# Altium schematic sheet SCH_03_Power.SchDoc
size A4; DrawnBy: Phung Nhat Minh; SheetNumber: 3; SheetTotal: 7
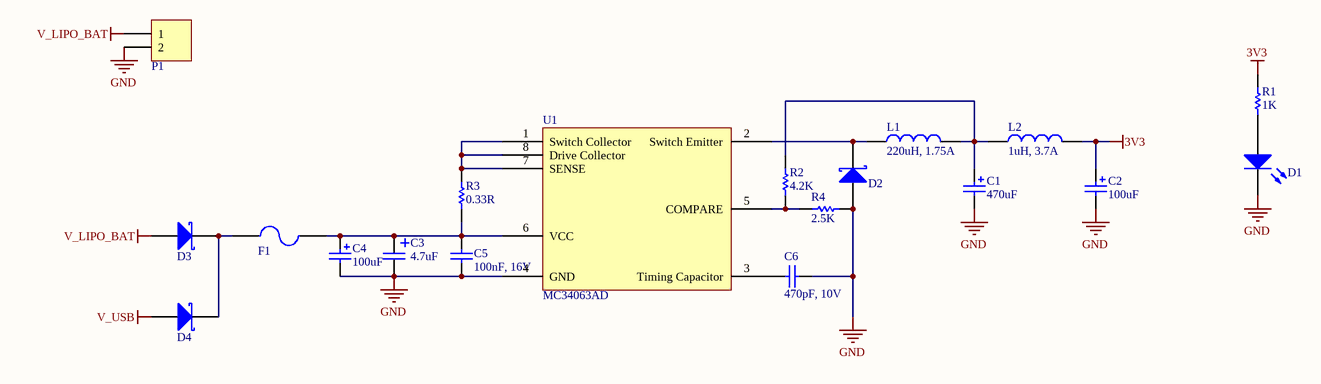
[diagram p0: SCH_03_Power.SchDoc]

## Parts
C1  value 470uF  [CAP ALU SIZE G]  (hidden comment: Cap Pol SMD)
C2  value 100uF  [CAP ALU SIZE D]  (hidden comment: Cap Pol SMD)
C3  value 4.7uF  [CAPMP3216X18N]  (hidden comment: Tantalum Capacitor)
C4  value 100uF  [CAP ALU SIZE D]  (hidden comment: Cap Pol SMD)
C5  100nF, 16V  [WCAP-CSGP_0805_H=0.8mm_Reflow]
C6  470pF, 10V  [WCAP-CSGP_0805_H=0.8mm_Reflow]
D1  LED SMD  [LED_0805_Blue]  (value not drawn)
D2  D Schottky  [SS34]  (value not drawn)
D3  D Schottky  [SS34]  (value not drawn)
D4  D Schottky  [SS34]  (value not drawn)
F1  Fuse  [FUSE SMD]  (value not drawn)
L1  220uH, 1.75A  [WE-PD2A_5848]
L2  1uH, 3.7A  [WE-PD2A_5848]
P1  Domino 2  [DOMINO 2- 5mm]  (value not drawn)
R1  value 1K  [RES-SM-0603]  (hidden comment: RESISTOR SMD)
R2  value 4.2K  [RES-SM-0805]  (hidden comment: RESISTOR SMD)
R3  value 0.33R  [RES-SM-0805]  (hidden comment: RESISTOR SMD)
R4  value 2.5K  [RES-SM-0805]  (hidden comment: RESISTOR SMD)
U1  MC34063AD  [SOIC127P600X170-8N]

## Nets
3V3: C2.1 L2.2 R1.2
GND: C1.2 C2.2 C3.2 C4.2 C5.1 C6.2 D1.2(K) D2.1(A) P1.2 R4.1 U1.4(GND)
V_LIPO_BAT: D3.1(A) P1.1
V_USB: D4.1(A)
NetC1_1: C1.1 L1.2 L2.1 R2.2
NetC3_1: C3.1 C4.1 C5.2 F1.2 R3.1 U1.6(VCC)
NetC6_1: C6.1 U1.3(Timing_Capacitor)
NetD1_1: D1.1(A) R1.1
NetD2_2: D2.2(K) L1.1 U1.2(Switch_Emitter)
NetD3_2: D3.2(K) D4.2(K) F1.1
NetR2_1: R2.1 R4.2 U1.5(COMPARE)
NetR3_2: R3.2 U1.1(Switch_Collector) U1.7(SENSE) U1.8(Drive_Collector)

## Notes on the sheet
- Title
- Size
- Date:
- A4
- Number
- Revision
- Time:
- Drawn By:
- Checked By:

## Library data of the parts
C1 C2 C4 = Cap Pol SMD: Polarized Capacitor (Radial)
C5 = 885012207045: WCAP-CSGP Multilayer Ceramic Chip Capacitor, General Purpose, size 0805, X7R, 100nF, 16V; Manufacturer: Wurth Elektronik; Rated Voltage: 16VDC; Isolation Resistance: >=5GOhm; Capacitance Tolerance: +/-10%; Technical Reference: X7R0805104K016DFCT10000; ComponentLink1Description: Manufacturer; ComponentLink1URL: http://www.we-online.de; ComponentLink2Description: Datasheet; ComponentLink2URL: https://www.we-online.com/catalog/datasheet/885012207045.pdf; Operating Temperature: -55 to +125degC; Packaging: Tape and Reel; Manufacturer Part Number: 885012207045; Published Date: May 2020; Ceramic Type: X7R; Dissipation Factor: =<3.5%; Height: 0.8mm; Mounting Technology: SMT; Size: 0805; Capacitance: 100nF
C6 = 885012207016: WCAP-CSGP Multilayer Ceramic Chip Capacitor, General Purpose, size 0805, X7R, 100nF, 10V; Manufacturer: Wurth Elektronik; Rated Voltage: 10VDC; Isolation Resistance: >=5GOhm; Capacitance Tolerance: +/-10%; Technical Reference: X7R0805104K010DFCT10000; ComponentLink1Description: Manufacturer; ComponentLink1URL: http://www.we-online.de; ComponentLink2Description: Datasheet; ComponentLink2URL: https://www.we-online.com/catalog/datasheet/885012207016.pdf; Operating Temperature: -55 to +125degC; Packaging: Tape and Reel; Manufacturer Part Number: 885012207016; Published Date: May 2020; Ceramic Type: X7R; Dissipation Factor: =<5%; Height: 0.8mm; Mounting Technology: SMT; Size: 0805; Capacitance: 100nF
D1 = LED SMD: LED
D2-D4 = D Schottky: Schottky Diode; Published: 8-Jun-2000; LatestRevisionDate: 17-Jul-2002; LatestRevisionNote: Re-released for DXP Platform.; PackageReference: SMB; Publisher: Altium Limited; PackageDescription: DO-214-AA/SMB; 2 C-Bend Leads; Body 5.3 x 3.6 mm, inc. leads (LxW); Code_JEDEC: DO-214-AA
L1 = 784774222: WE-PD2A SMT Power Inductor, size 5848, 220uH, 0.41A; Manufacturer: Wurth Elektronik; DC Resistance max.: 1.57Ohm; Saturation Current: 0.47A; Self Resonant Frequency: 5MHz; DC Resistance typ.: 0.945Ohm; Rated Voltage: 80VDC; ComponentLink1Description: Manufacturer; ComponentLink1URL: http://www.we-online.de; ComponentLink2Description: Datasheet; ComponentLink2URL: https://www.we-online.com/catalog/datasheet/784774222.pdf; Manufacturer Part Number: 784774222; Published Date: May 2020; Rated Current: 0.41A; Inductance: 220uH; Operating Temperature: -40 to +125degC; Mounting Technology: SMT; Packaging: Tape and Reel; Size: 5848
L2 = 784774003: WE-PD2A SMT Power Inductor, size 5848, 0.33uH, 10.8A; Manufacturer: Wurth Elektronik; DC Resistance max.: 0.008Ohm; Saturation Current: 15.3A; Self Resonant Frequency: 295MHz; DC Resistance typ.: 0.006Ohm; Rated Voltage: 80VDC; ComponentLink1Description: Manufacturer; ComponentLink1URL: http://www.we-online.de; ComponentLink2Description: Datasheet; ComponentLink2URL: https://www.we-online.com/catalog/datasheet/784774003.pdf; Manufacturer Part Number: 784774003; Published Date: May 2020; Rated Current: 10.8A; Inductance: 0.33uH; Operating Temperature: -40 to +125degC; Mounting Technology: SMT; Packaging: Tape and Reel; Size: 5848
P1 = Domino 2: Domino, 2-Pin; LatestRevisionDate: 17-Jul-2002; LatestRevisionNote: Re-released for DXP Platform.; Publisher: Altium Limited
R1-R4 = RESISTOR SMD: Resistor
U1 = MC34063: 1.5-A boost, buck, inverting switching regulator, operation from 0°C to 70°C; Manufacturer: Texas Instruments; ComponentLink1Description: Local Supplier Link; ComponentLink1URL: https://www.thegioiic.com/products/mc34063ad-ic-dieu-chinh-tang-giam-ap-1-5a-8-soic; Local Supplier: Thegioiic; Local Supplier P/N: MC34063AD; Manufacturer P/N: MC34063AD